# EAGLE design G1Tech-MCP4725-PCB_v02 (EAGLE 9.0.0)
CNAME: MCP4725; CREVISION: A; DESIGNER: Nick
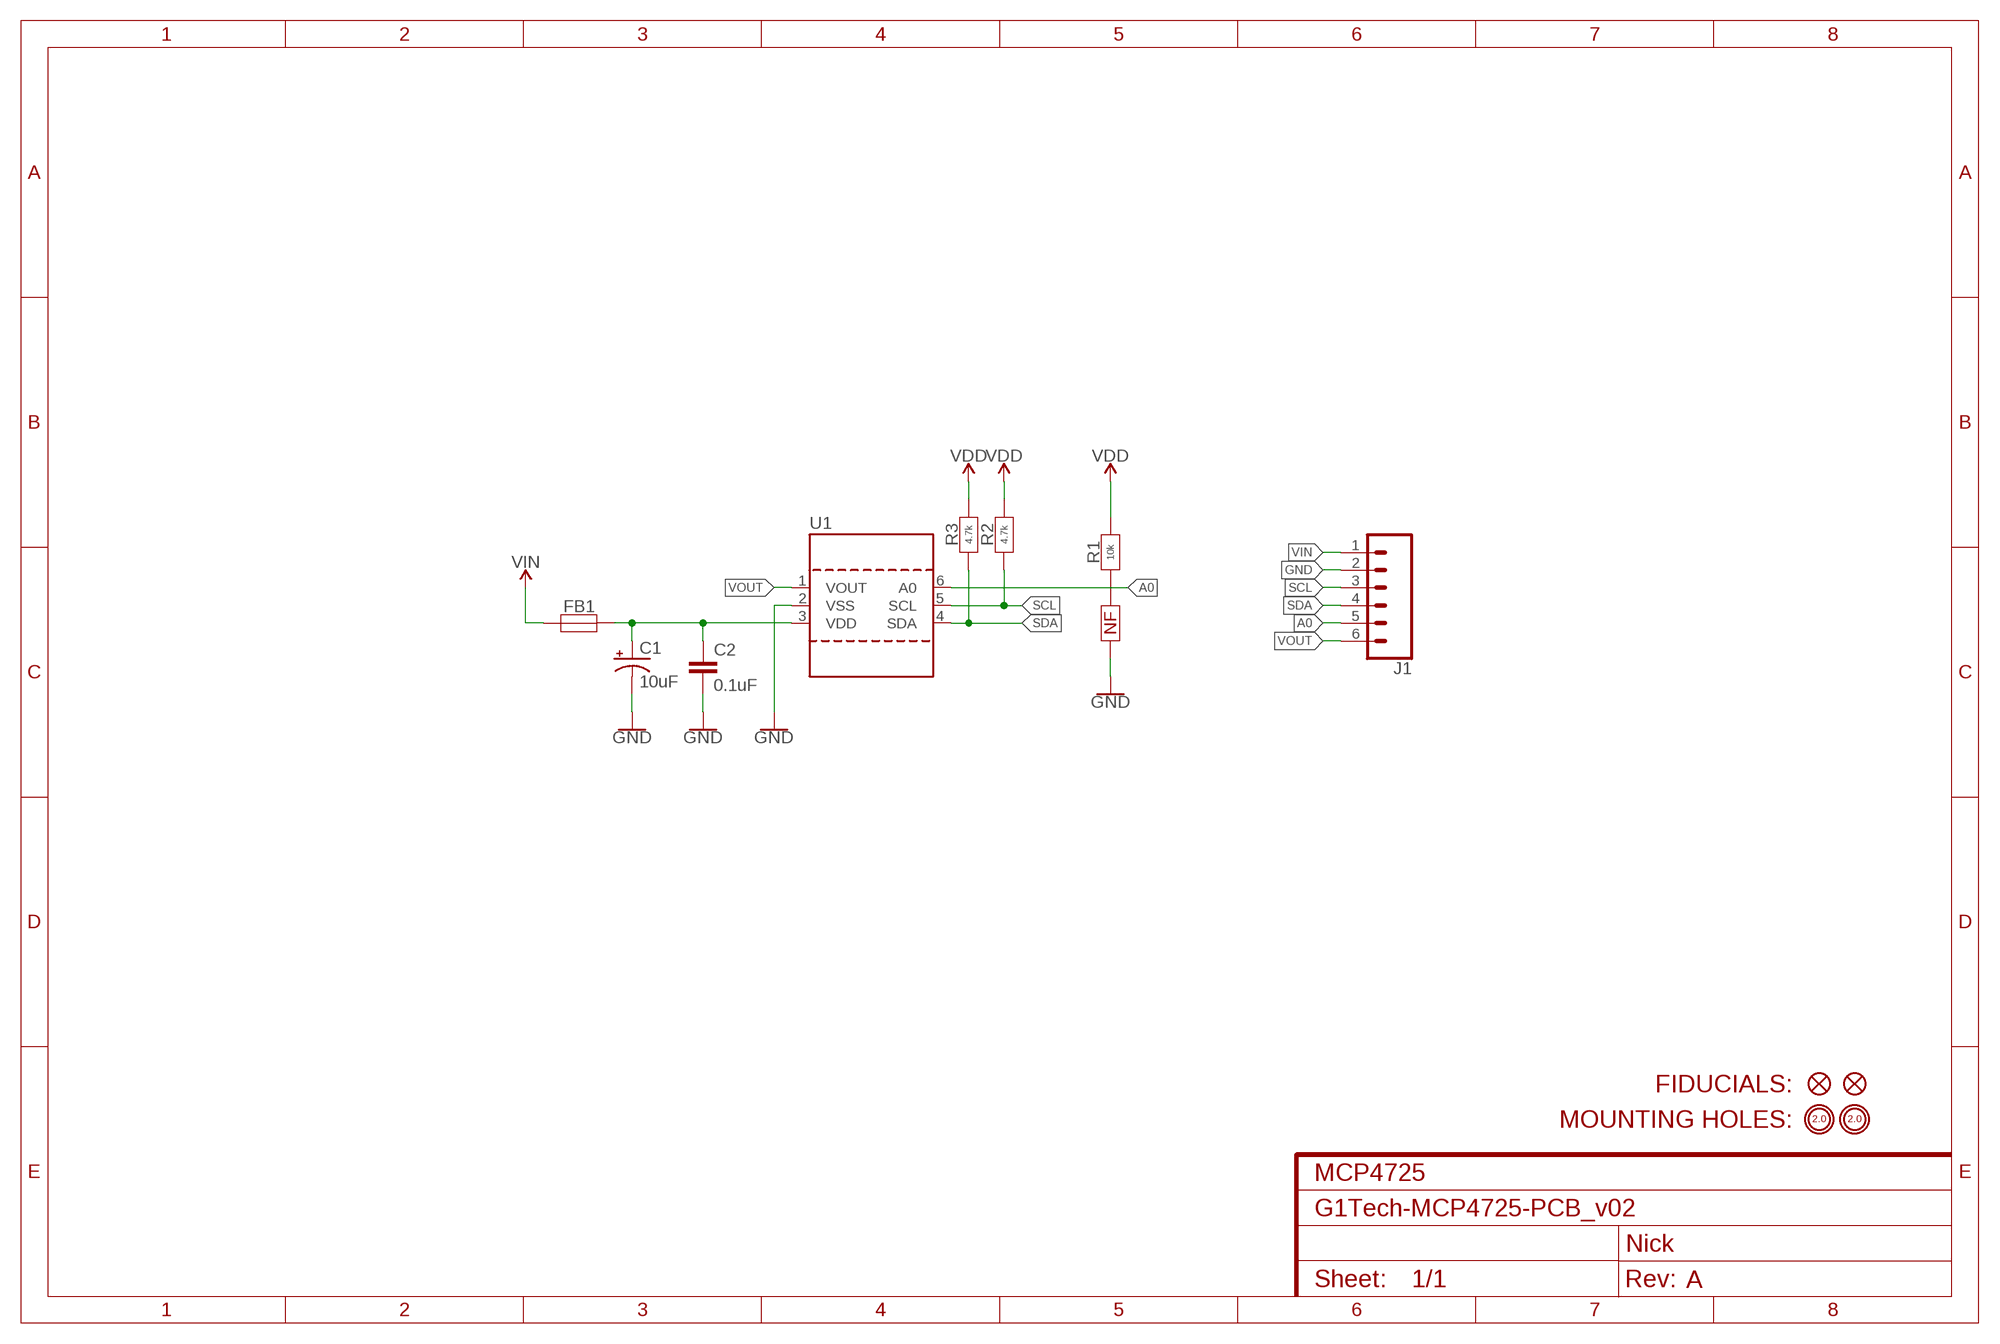
[diagram p0: schematic, sheet 1]

## Parts
C1  10uF  C-TYPE-A  [TYPE-A]
C2  0.1uF  C0603  [C0603]
FB1  FERRITE-BEAD-0603  [FB-0603]
FD1  FIDUCIAL-1X2  [FIDUCIAL-1X2]
FD2  FIDUCIAL-1X2  [FIDUCIAL-1X2]
H1  MOUNTINGHOLE-PLATED-2.0  [MOUNTINGHOLE-PLATED-2.0]
H2  MOUNTINGHOLE-PLATED-2.0  [MOUNTINGHOLE-PLATED-2.0]
J1  CONN-1X6  [1X06_NO_SILK]
R1  10k  JUMPER-0RJP0603-YAGEO  [YAGEO-JP0603]
R2  4.7k  YAGEO-R0603  [YAGEO-R0603]
R3  4.7k  YAGEO-R0603  [YAGEO-R0603]
U1  MCP4725  [SOT23-6]

## Nets
A0: J1.5 R1.2 U1.6(A0)
GND: C1.C C2.2 J1.2 R1.3 U1.2(VSS)
SCL: J1.3 R2.1 U1.5(SCL)
SDA: J1.4 R3.1 U1.4(SDA)
VDD: C1.A C2.1 FB1.2 R1.1 R2.2 R3.2 U1.3(VDD)
VIN: FB1.1 J1.1
VOUT: J1.6 U1.1(VOUT)

## Library data of the parts
C1 = G1Tech-Capacitors:C-TYPE-A
C2 = G1Tech-Capacitors:C0603
FB1 = G1Tech-Filters:FERRITE-BEAD-0603: BLM18KG101TN1D https://media.digikey.com/pdf/Data%20Sheets/Murata%20PDFs/BLM18yyyyyyN1x.pdf
FD1 FD2 = G1Tech-Design:FIDUCIAL-1X2
H1 H2 = G1Tech-Design:MOUNTINGHOLE-PLATED-2.0
J1 = G1Tech-Connectors:CONN-1X6
R1 = G1Tech-Resistors:JUMPER-0R
R2 R3 = G1Tech-Resistors:YAGEO-R0603: YAGEO Resistor R0603
U1 = G1Tech-Integrated-Circuits:MCP4725: http://ww1.microchip.com/downloads/en/DeviceDoc/22039d.pdf

## Board
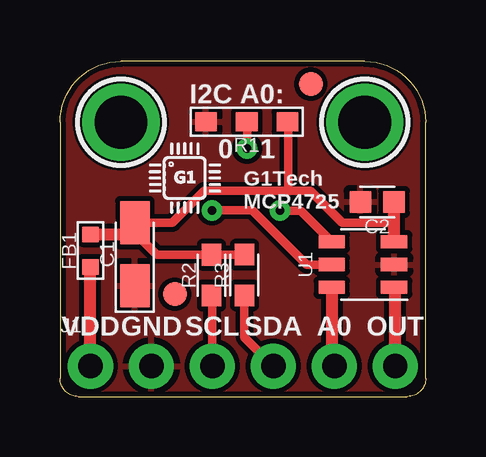
[diagram p1: board, top side]
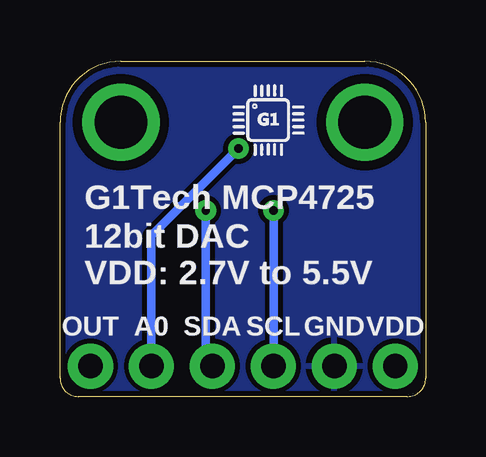
[diagram p2: board, bottom side, seen from below]

Size 15.24 x 13.97 mm. Coordinates in mm from the lower left corner, seen from the top.
Outline: 0.76,0 14.48,0 arc90 15.24,0.76 15.24,11.43 arc90 12.7,13.97 2.54,13.97 arc90 0,11.43 0,0.76 arc90 0.76,0
Copper layers (1*16): Top 0.035mm / dielectric 1.5mm / Bottom 0.035mm
Design rules "SparkFun": minimum track width 8mil, minimum drill 20mil, track to track 8mil, track to pad 8mil, pad to pad 8mil, via to via 8mil, smd to smd 8mil, copper to edge 9mil, drill to drill 8mil, minimum pad ring 12mil, minimum via ring 10mil, stop-mask expansion 4mil, vias tented up to drill 20mil, thermal gap 10mil

### Footprints (pad centres in the part's own frame; a part is rotated, then mirrored left to right if it is on the bottom)
TYPE-A = smd 1.8 x 1.23: A 1.31,0; C -1.31,0
C0603 = smd 0.9 x 0.9: 1 -0.7,0; 2 0.7,0
FB-0603 = smd 0.65 x 0.7: 1 -0.675,0; 2 0.675,0
FIDUCIAL-1X2 = smd 1 x 1: 1 0,0
MOUNTINGHOLE-PLATED-2.0 = drill 2.2: P$1 0,0
1X06_NO_SILK = drill 1.016 pad 1.88: 1 0,0; 2 2.54,0; 3 5.08,0; 4 7.62,0; 5 10.16,0; 6 12.7,0
YAGEO-JP0603 = smd 0.9 x 0.8: 1 -1.7,0; 2 0,0; 3 1.7,0
YAGEO-R0603 = smd 0.9 x 0.8: 1 -0.85,0; 2 0.85,0
SOT23-6 = smd 0.55 x 1.1: 1 -0.95,-1.3; 2 0,-1.3; 3 0.95,-1.3; 4 0.95,1.3; 5 0,1.3; 6 -0.95,1.3

### Placement (x,y rotation side)
C1  3.12,5.93 90 top
C2  13.22,8.11 180 top
FB1  1.27,6.08 90 top
FD1  4.79,4.27 0 top
FD2  10.45,13.02 0 top
H1  2.54,11.43 0 top
H2  12.7,11.43 0 top
J1  1.27,1.27 0 top
R1  7.78,11.45 180 top
R2  6.32,5.06 90 top
R3  7.68,5.06 90 top
U1  12.62,5.5 90 top
U$1  [LOGO-G1TECH-3MM]  3.71,7.62 0 top
U$2  [LOGO-G1TECH-3MM]  8.05,10.03 0 bottom

### Tracks (layer width: path | path; a pad name or v marks a point on that pad's centre or on a via)
A0  (via drill 0.35)
  Top 0.35: v7.8,10.34 7.8,11.43 R1.2
  Top 0.508: U1.6 11.32,1.38 J1.5
  Bottom 0.35: J1.5 11.43,6.71 v7.8,10.34
GND
  pour Top: 0,0 0,13.97 15.24,13.97 15.24,0
  pour Bottom: 0,0 0,13.97 15.24,13.97 15.24,0
SCL  (via drill 0.35)
  Top 0.35: U1.5 10.27,5.5 8.01,7.76 v6.34,7.76 | J1.3 6.35,4.17 R2.1
  Bottom 0.35: v6.34,7.76 J1.3
SDA  (via drill 0.35)
  Top 0.35: U1.4 10.03,7.75 v9.17,7.75 | R3.1 7.68,2.48 J1.4
  Bottom 0.35: v9.17,7.75 9.17,1.55 J1.4
VDD
  Top 0.35: 13.92,7.27 13.89,7.24 11.75,7.24 10.43,8.57 9.5,8.57 | C1.A 4.68,7.24 6.01,8.57 9.5,8.57 | R3.2 R2.2 4.03,5.91 2.91,7.03 | R1.1 9.5,11.43 9.5,8.57
  Top 0.508: U1.3 13.92,7.27 C2.1 | FB1.2 2.63,6.75 2.91,7.03 C1.A
VIN
  Top 0.508: J1.1 FB1.1
VOUT
  Top 0.508: J1.6 13.97,4.5 U1.1

### Text on the board
tPlace: I2C A0: | 0 | 1 | G1Tech / MCP4725 | VDD | GND | SCL | SDA | A0 | OUT
bPlace: G1Tech MCP4725 | 12bit DAC / VDD: 2.7V to 5.5V | VDD | GND | SCL | SDA | A0 | OUT